# Altium schematic sheet LED_Board.SchDoc
size A
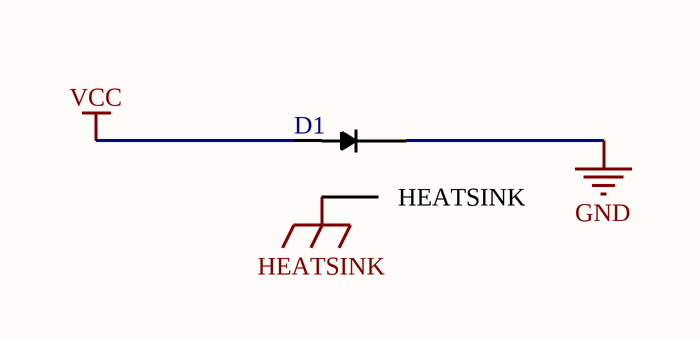
[diagram p0: LED_Board.SchDoc]

## Parts
D1  DIODE_WITH_HEATSINK  (value not drawn)

## Nets
GND: D1.1(K)
HEATSINK: D1.3(HEATSINK)
VCC: D1.2(A)